# Altium schematic sheet Card_reader.SchDoc
size A4
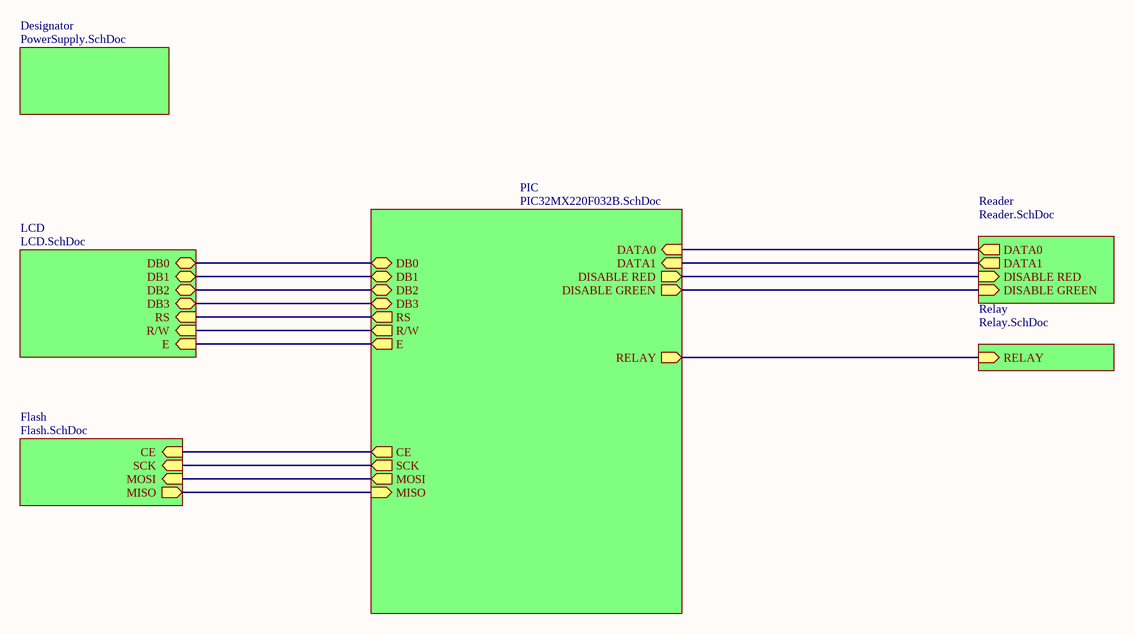
[diagram p0: Card_reader.SchDoc]

## Sub-sheets
Designator = PowerSupply.SchDoc: no entries
Flash = Flash.SchDoc: CE (in), SCK (in), MOSI (in), MISO (out)
LCD = LCD.SchDoc: DB0 (bidir), DB1 (bidir), DB2 (bidir), DB3 (bidir), RS (in), R/W (in), E (in)
PIC = PIC32MX220F032B.SchDoc: DATA0 (in), RELAY (out), DB0 (bidir), DATA1 (in), DISABLE RED (out), DISABLE GREEN (out), DB1 (bidir), DB2 (bidir), DB3 (bidir), RS (out), R/W (out), E (out), CE (out), SCK (out), MOSI (out), MISO (in)
Reader = Reader.SchDoc: DATA0 (out), DATA1 (out), DISABLE RED (in), DISABLE GREEN (in)
Relay = Relay.SchDoc: RELAY (in)

## Nets
(unnamed): sheet PIC/DATA0, sheet Reader/DATA0
(unnamed): sheet PIC/RELAY, sheet Relay/RELAY
(unnamed): sheet PIC/DB0, sheet LCD/DB0
(unnamed): sheet PIC/DATA1, sheet Reader/DATA1
(unnamed): sheet PIC/DISABLE RED, sheet Reader/DISABLE RED
(unnamed): sheet PIC/DISABLE GREEN, sheet Reader/DISABLE GREEN
(unnamed): sheet PIC/DB1, sheet LCD/DB1
(unnamed): sheet PIC/DB2, sheet LCD/DB2
(unnamed): sheet PIC/DB3, sheet LCD/DB3
(unnamed): sheet PIC/RS, sheet LCD/RS
(unnamed): sheet PIC/R/W, sheet LCD/R/W
(unnamed): sheet PIC/E, sheet LCD/E
(unnamed): sheet PIC/CE, sheet Flash/CE
(unnamed): sheet PIC/SCK, sheet Flash/SCK
(unnamed): sheet PIC/MOSI, sheet Flash/MOSI
(unnamed): sheet PIC/MISO, sheet Flash/MISO

## Notes on the sheet
- Title
- Size:
- Date:
- A4
- Number:
- Time:
- Revision:
- Sheet
- of
- File: